# Altium schematic sheet PCB_01_02.SchDoc
size A
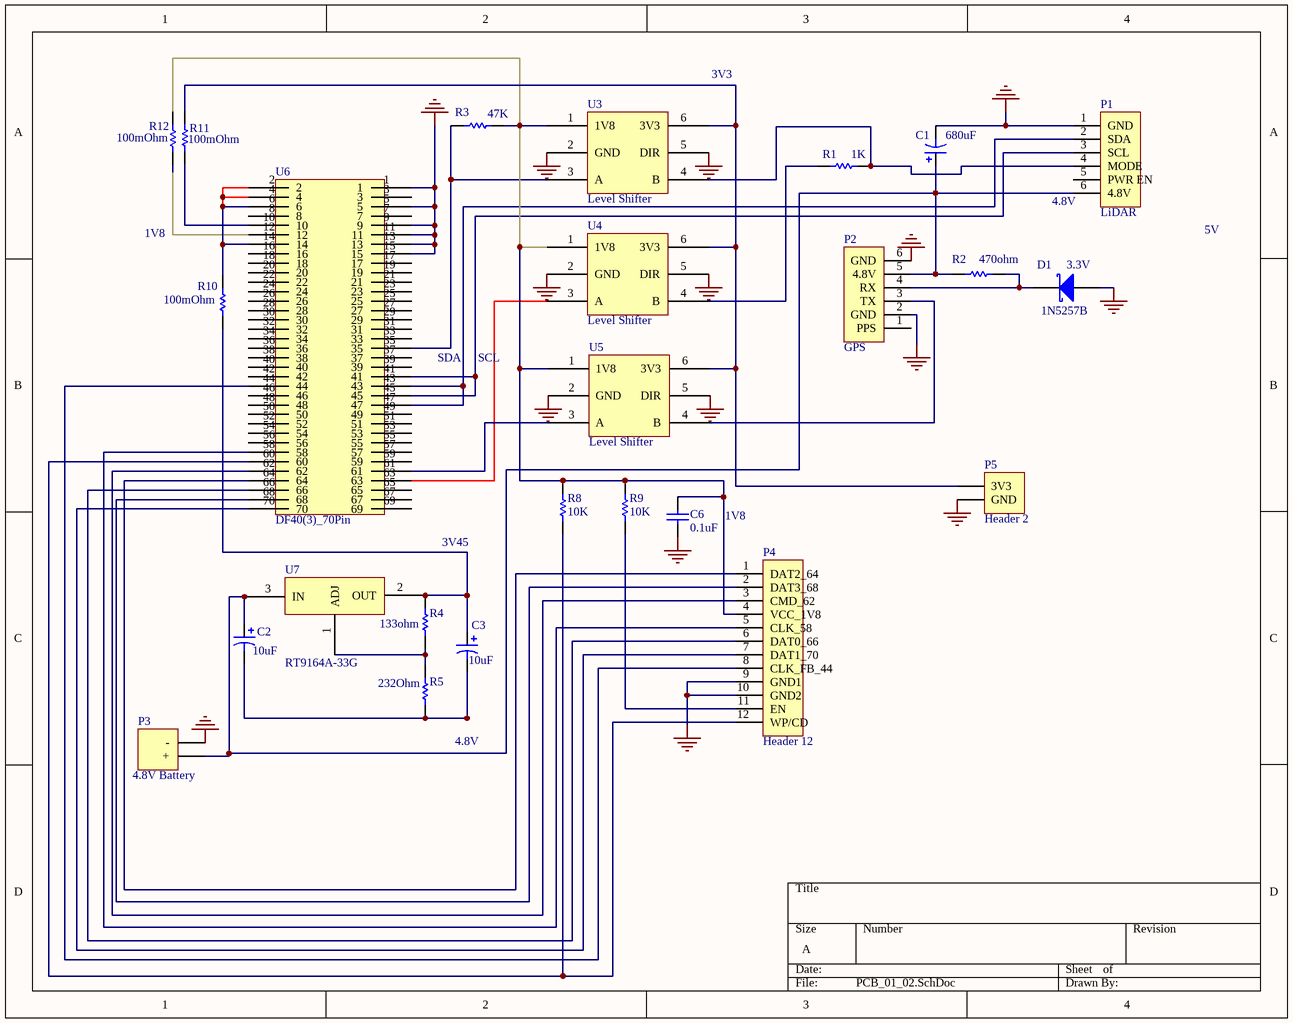
[diagram p0: PCB_01_02.SchDoc]

## Parts
C1  value 680uF  [RB7.6-15]  (hidden comment: Cap Pol1)
C2  value 10uF  [RB7.6-15]  (hidden comment: Cap Pol1)
C3  value 10uF  [RB7.6-15]  (hidden comment: Cap Pol1)
C6  value 0.1uF  [RAD-0.3]  (hidden comment: Cap)
D1_3.3V  1N5257B  [TO-220AC]
P1  LiDAR  [HDR1X6]
P2  GPS  [HDR1X6]
P3  4.8V Battery  [HDR1X2]
P4  Header 12  [HDR1X12]
P5  Header 2  [HDR1X2]
R1  value 1K  [AXIAL-0.3]  (hidden comment: Res1)
R2  value 470ohm  [AXIAL-0.3]  (hidden comment: Res1)
R3  value 47K  [AXIAL-0.3]  (hidden comment: Res1)
R4  value 133ohm  [AXIAL-0.3]  (hidden comment: Res1)
R5  value 232Ohm  [AXIAL-0.3]  (hidden comment: Res1)
R8  value 10K  [AXIAL-0.3]  (hidden comment: Res1)
R9  value 10K  [AXIAL-0.3]  (hidden comment: Res1)
R10  value 100mOhm  [AXIAL-0.3]  (hidden comment: Res1)
R11  value 100mOhm  [AXIAL-0.3]  (hidden comment: Res1)
R12  value 100mOhm  [AXIAL-0.3]  (hidden comment: Res1)
U3  Level Shifter  [74LVC1T45]
U4  Level Shifter  [74LVC1T45]
U5  Level Shifter  [74LVC1T45]
U6  DF40(3)_70Pin  [DF40(2)_70PIN_02]
U7  RT9164A-33G  [RT9164A-33GG]

## Nets
GND: C6.1 P3.2(-) P4.9(GND1) P4.10(GND2) P5.2(GND) U3.2(GND) U3.5(DIR) U4.2(GND) U4.5(DIR) U5.2(GND) U5.5(DIR) U6.1 U6.5 U6.9 U6.11 U6.13 U6.15
NetC1_2: C1.2 D1_3.3V.3(A) P1.1(GND) P2.2(GND) P2.6(GND)
NetC1_1: C1.1 C2.1 P1.6(4.8V) P2.5(4.8V) P3.1(+) R2.1 U7.3(IN)
NetC2_2: C2.2 C3.2 R5.2
NetC3_1: C3.1 R4.1 R10.1 U7.2(OUT)
NetC6_2: C6.2 P4.4(VCC_1V8) R3.2 R8.2 R9.2 R12.2 U3.1(1V8) U4.1(1V8) U5.1(1V8)
NetD1_3.3V_1: D1_3.3V.1(K) P2.4(RX) R2.2
NetP1_2: P1.2(SDA) U6.43 U6.47
NetP1_3: P1.3(SCL) U6.41 U6.45
NetP1_4: P1.4(MODE) R1.2 U3.4(B)
NetP2_3: P2.3(TX) U5.4(B)
NetP4_1: P4.1(DAT2_64) U6.64
NetP4_2: P4.2(DAT3_68) U6.68
NetP4_3: P4.3(CMD_62) U6.62
NetP4_5: P4.5(CLK_58) U6.58
NetP4_6: P4.6(DAT0_66) U6.66
NetP4_7: P4.7(DAT1_70) U6.70
NetP4_8: P4.8(CLK_FB_44) U6.44
NetP4_11: P4.11(EN) R9.1
NetP4_12: P4.12(WP/CD) R8.1 U6.60
NetP5_1: P5.1(3V3) U3.6(3V3) U4.6(3V3) U5.6(3V3)
NetR1_1: R1.1 U4.4(B)
NetR3_1: R3.1 U3.3(A) U6.35
NetR4_2: R4.2 R5.1 U7.1(ADJ)
NetR10_2: R10.2 U6.2 U6.4 U6.6 U6.14
NetR11_1: R11.1 U6.10
NetR12_1: R12.1 U6.12
NetU4_3: U4.3(A) U6.63
NetU5_3: U5.3(A) U6.61

Not connected (* = marked no-connect by the designer): P1 5(PWR_EN); P2 1(PPS); R11 2; U6 3 7 8 16 17 18 19 20 21 22 23 24 25 26 27 28 29 30 31 32 33 34 36 37 38 39 40 42 46 48 49 50 51 52 53 54 55 56 57 59 65 67 69

## Notes on the sheet
- 3V3
- 1V8
- (near P1) 4.8V
- 5V
- SDA
- SCL
- 3V45
- (near R5) 4.8V

## Library data of the parts
C1-C3 = Cap Pol1: Polarized Capacitor (Radial); Published: 8-Jun-2000; LatestRevisionDate: 17-Jul-2002; LatestRevisionNote: Re-released for DXP Platform.; PackageReference: RB7.6-15; Publisher: Altium Limited; PackageDescription: Polarized Capacitor (Radial); 2 Leads
C6 = Cap: Capacitor; Published: 8-Jun-2000; LatestRevisionDate: 17-Jul-2002; LatestRevisionNote: Re-released for DXP Platform.; PackageReference: RAD-0.3; Publisher: Altium Limited; PackageDescription: Radial Cap, Thru-Hole; 2 Leads; 0.3 in Pin Spacing
D1_3.3V = Diode 10TQ040: Schottky Rectifier; Note: Terminal 2 is the TAB and is electrically connected to the cathode; Published: 8-Jun-2000; LatestRevisionDate: 17-Jul-2002; LatestRevisionNote: Re-released for DXP Platform.; DatasheetVersion: PD-2.057B; PackageVersion: Feb-1998; PackageReference: TO-220AC; Publisher: Altium Limited; PackageDescription: TO, Thru-Hole, Vertical, Heatsink Mounted; 3 In-Line Leads (1 Absent); Pitch 2.54 mm; ComponentLink1Description: Manufacturer Link; ComponentLink1URL: http://www.irf.com/
P1 = Header 6: Header, 6-Pin, for LiDAR; LatestRevisionDate: 17-Jul-2002; LatestRevisionNote: Re-released for DXP Platform.; Publisher: Altium Limited
P2 = Header 6: Header, 6-Pin, for GPS; LatestRevisionDate: 17-Jul-2002; LatestRevisionNote: Re-released for DXP Platform.; Publisher: Altium Limited
P3 = Header 2H: Header, 2-Pin, Right Angle; LatestRevisionDate: 17-Jul-2002; LatestRevisionNote: Re-released for DXP Platform.; Publisher: Altium Limited
P4 = Header 12: Header, 12-Pin; LatestRevisionDate: 17-Jul-2002; LatestRevisionNote: Re-released for DXP Platform.; Publisher: Altium Limited
P5 = Header 2: Header, 2-Pin; LatestRevisionDate: 17-Jul-2002; LatestRevisionNote: Re-released for DXP Platform.; Publisher: Altium Limited
R1-R5 R8-R12 = Res1: Resistor; Published: 8-Jun-2000; LatestRevisionDate: 17-Jul-2002; LatestRevisionNote: Re-released for DXP Platform.; PackageReference: AXIAL-0.3; Publisher: Altium Limited; PackageDescription: Axial Device, Thru-Hole; 2 Leads; 0.3 in Pin Spacing
U3-U5 = Component_1: 74LVC1T45 Level Shifter
U7 = RT9164A-33G: PW REG